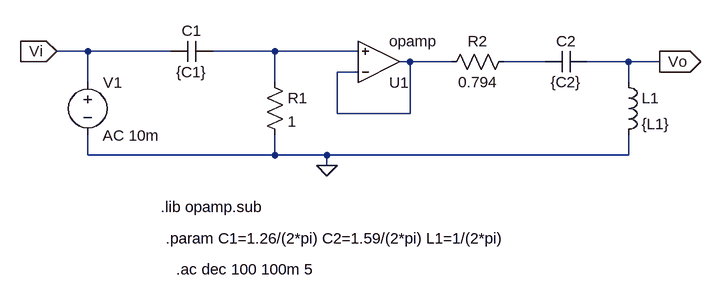
[diagram p0: schematic Ts4_Pasivo.asc]
Ts4_Pasivo.asc, the LTspice schematic file:
Version 4
SHEET 1 880 680
WIRE -128 112 -176 112
WIRE 0 112 -128 112
WIRE 160 112 64 112
WIRE 288 112 160 112
WIRE 368 128 352 128
WIRE 432 128 368 128
WIRE 576 128 512 128
WIRE 704 128 640 128
WIRE 752 128 704 128
WIRE 288 144 256 144
WIRE -128 160 -128 112
WIRE 160 160 160 112
WIRE 704 160 704 128
WIRE 256 208 256 144
WIRE 368 208 368 128
WIRE 368 208 256 208
WIRE -128 272 -128 240
WIRE 160 272 160 240
WIRE 160 272 -128 272
WIRE 240 272 160 272
WIRE 704 272 704 240
WIRE 704 272 240 272
WIRE 240 288 240 272
FLAG 240 288 0
FLAG 752 128 Vo
IOPIN 752 128 Out
FLAG -176 112 Vi
IOPIN -176 112 In
SYMBOL cap 64 96 R90
WINDOW 0 0 32 VBottom 2
WINDOW 3 32 32 VTop 2
SYMATTR InstName C1
SYMATTR Value {C1}
SYMBOL res 144 144 R0
SYMATTR InstName R1
SYMATTR Value 1
SYMBOL res 528 112 R90
WINDOW 0 0 56 VBottom 2
WINDOW 3 32 56 VTop 2
SYMATTR InstName R2
SYMATTR Value 0.794
SYMBOL cap 640 112 R90
WINDOW 0 0 32 VBottom 2
WINDOW 3 32 32 VTop 2
SYMATTR InstName C2
SYMATTR Value {C2}
SYMBOL ind 688 144 R0
SYMATTR InstName L1
SYMATTR Value {L1}
SYMBOL OpAmps\\opamp 320 192 M180
SYMATTR InstName U1
SYMBOL voltage -128 144 R0
WINDOW 123 23 98 Left 2
WINDOW 39 0 0 Left 0
SYMATTR Value2 AC 10m
SYMATTR InstName V1
SYMATTR Value ""
TEXT -16 352 Left 2 !.lib opamp.sub
TEXT -8 400 Left 2 !.param C1=1.26/(2*pi) C2=1.59/(2*pi) L1=1/(2*pi)
TEXT 8 448 Left 2 !.ac dec 100 100m 5

The netlist it stands for:
* Ts4_Pasivo.asc
C1 N001 Vi {C1}
R1 N001 0 1
R2 N003 N002 0.794
C2 Vo N003 {C2}
L1 Vo 0 {L1}
XU1 N002 N001 N002 opamp Aol=100K GBW=10Meg  ; pins invin noninvin out
V1 Vi 0 AC 10m
.lib opamp.sub
.param C1=1.26/(2*pi) C2=1.59/(2*pi) L1=1/(2*pi)
.ac dec 100 100m 5
.backanno
.end

* Results of the author's LTspice run, read from the files saved beside the schematic
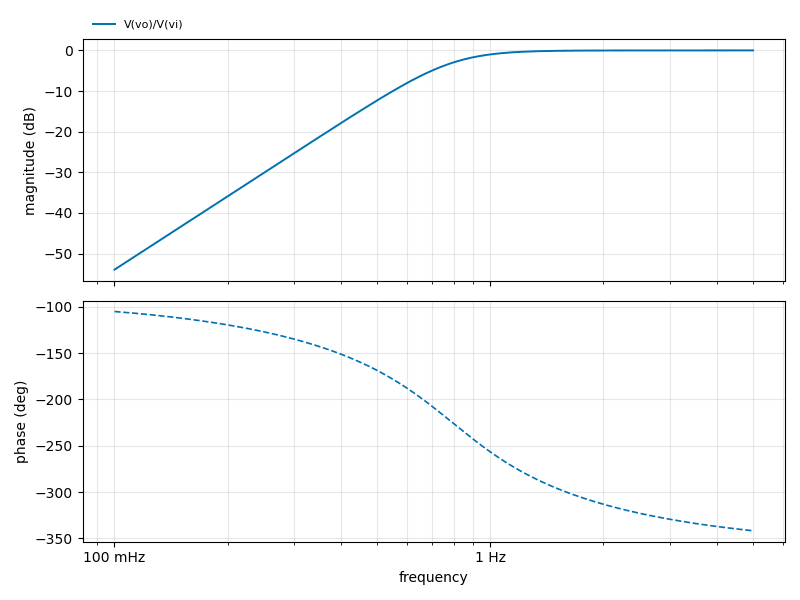
[diagram p1: AC Analysis of Ts4_Pasivo.asc, plotted from the saved traces]
* AC Analysis, 1 run:
*   V(vo)/V(vi): -53.96 dB at 100 mHz, -0.00 dB at 5 Hz, peak -0.00 dB at 5 Hz, 3 dB below the peak at 794.5 mHz